# Altium schematic sheet atmega_darlington_diodes.SchDoc
size A4
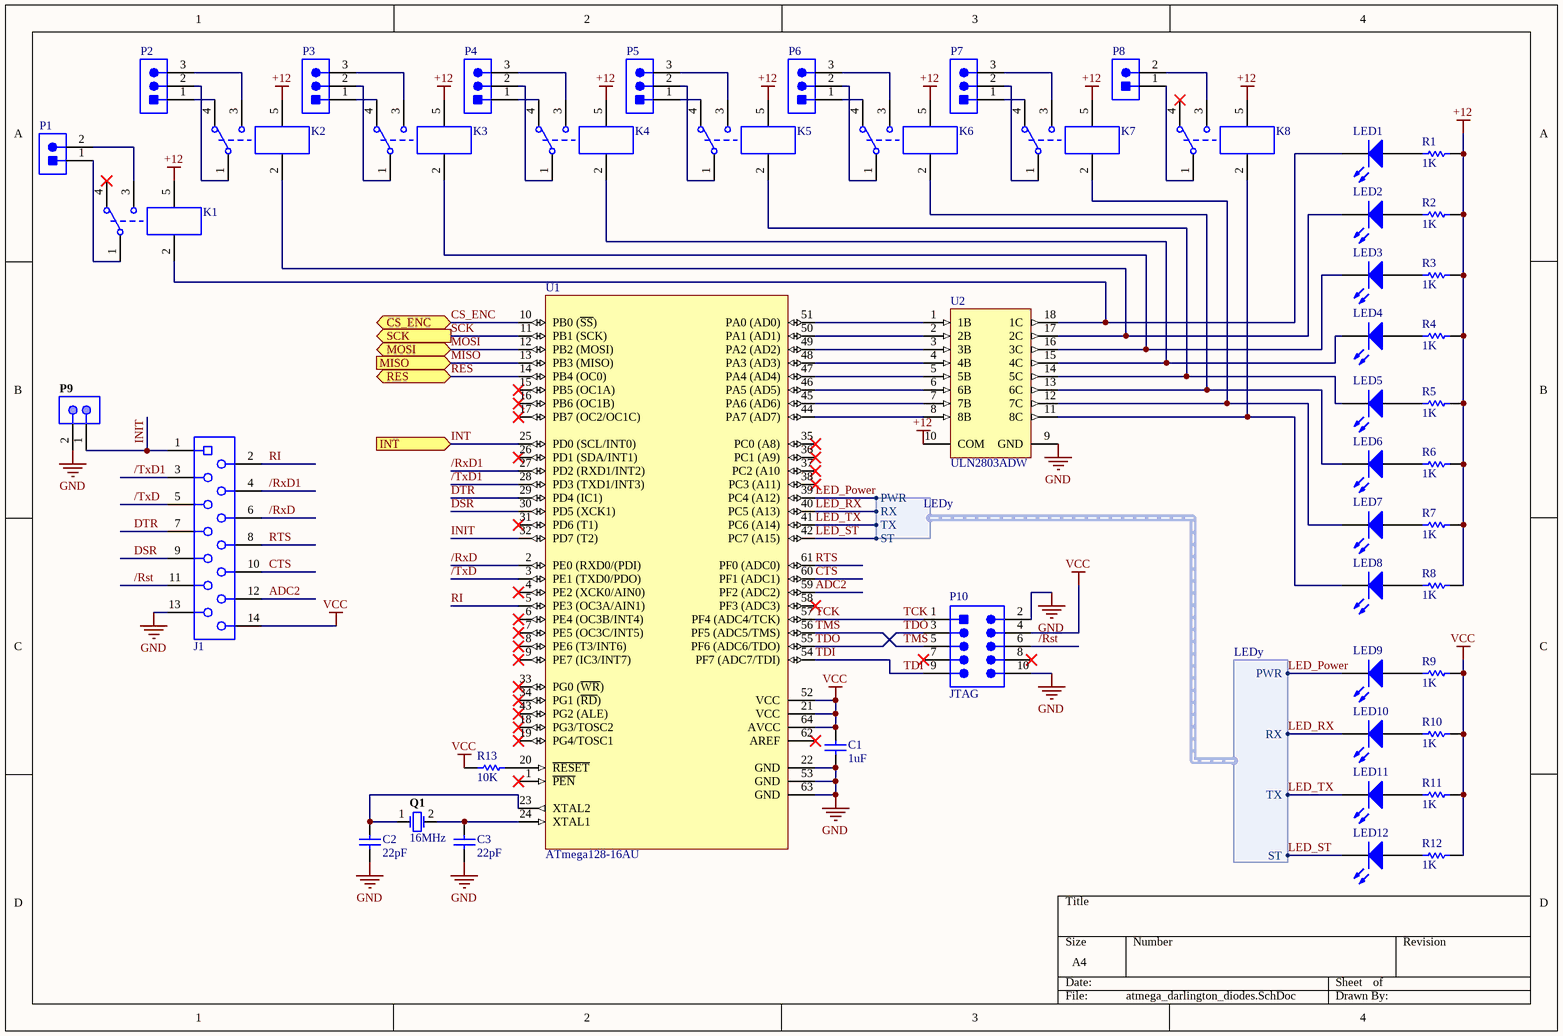
[diagram p0: atmega_darlington_diodes.SchDoc]

## Parts
C1  1uF  [CAPC1206(3216)130_L]
C2  22pF  [CAPC1206(3216)100_L]
C3  22pF  [CAPC1206(3216)100_L]
J1  490107671412  [490107671412]  (value not drawn)
K1  JS1-12V  [PNSC-JS1-12V_V]  (value not drawn)
K2  JS1-12V  [PNSC-JS1-12V_V]  (value not drawn)
K3  JS1-12V  [PNSC-JS1-12V_V]  (value not drawn)
K4  JS1-12V  [PNSC-JS1-12V_V]  (value not drawn)
K5  JS1-12V  [PNSC-JS1-12V_V]  (value not drawn)
K6  JS1-12V  [PNSC-JS1-12V_V]  (value not drawn)
K7  JS1-12V  [PNSC-JS1-12V_V]  (value not drawn)
K8  JS1-12V  [PNSC-JS1-12V_V]  (value not drawn)
LED1  150120YS75000  [1206_A]  (value not drawn)
LED2  150120YS75000  [1206_A]  (value not drawn)
LED3  150120YS75000  [1206_A]  (value not drawn)
LED4  150120YS75000  [1206_A]  (value not drawn)
LED5  150120YS75000  [1206_A]  (value not drawn)
LED6  150120YS75000  [1206_A]  (value not drawn)
LED7  150120YS75000  [1206_A]  (value not drawn)
LED8  150120YS75000  [1206_A]  (value not drawn)
LED9  150120BS75000  [1206_A]  (value not drawn)
LED10  150120GS75000  [1206_A]  (value not drawn)
LED11  150120YS75000  [1206_A]  (value not drawn)
LED12  150120RS75000  [1206_A]  (value not drawn)
P1  SCREW-5.0/5.08 2WAYS  [SCREW-5.0-2WAYS_V]  (value not drawn)
P2  SCREW-5.0/5.08 3WAYS  [SCREW-5.0-3WAYS_V]  (value not drawn)
P3  SCREW-5.0/5.08 3WAYS  [SCREW-5.0-3WAYS_V]  (value not drawn)
P4  SCREW-5.0/5.08 3WAYS  [SCREW-5.0-3WAYS_V]  (value not drawn)
P5  SCREW-5.0/5.08 3WAYS  [SCREW-5.0-3WAYS_V]  (value not drawn)
P6  SCREW-5.0/5.08 3WAYS  [SCREW-5.0-3WAYS_V]  (value not drawn)
P7  SCREW-5.0/5.08 3WAYS  [SCREW-5.0-3WAYS_V]  (value not drawn)
P8  SCREW-5.0/5.08 2WAYS  [SCREW-5.0-2WAYS_V]  (value not drawn)
P9  PH2541-2-SPGRH-6-3  [PH2541-2-SPGRH-6-3_V]  (value not drawn)
P10  JTAG  [3M-2510-6002_V]
Q1  16MHz  [JPY-HC-49US]
R1  1K  [RESC1206(3216)_L]
R2  1K  [RESC1206(3216)_L]
R3  1K  [RESC1206(3216)_L]
R4  1K  [RESC1206(3216)_L]
R5  1K  [RESC1206(3216)_L]
R6  1K  [RESC1206(3216)_L]
R7  1K  [RESC1206(3216)_L]
R8  1K  [RESC1206(3216)_L]
R9  1K  [RESC1206(3216)_L]
R10  1K  [RESC1206(3216)_L]
R11  1K  [RESC1206(3216)_L]
R12  1K  [RESC1206(3216)_L]
R13  10K  [RESC1206(3216)_L]
U1  ATmega128-16AU  [64A_L]
U2  ULN2803ADW  [DW0018A_L]

## Ports
CS_ENC (bidir), INT (in), MISO (in), MOSI (bidir), RES (bidir), SCK (out)

## Harnesses
LEDy: PWR, RX, TX, ST

## Nets
+12: K1.5 K2.5 K3.5 K4.5 K5.5 K6.5 K7.5 K8.5 R1.2 R2.2 R3.2 R4.2 R5.2 R6.2 R7.2 R8.2 U2.10(COM)
GND: C1.1 C2.1 C3.1 J1.13 P9.2 P10.2 P10.10 U1.22(GND) U1.53(GND) U1.63(GND) U2.9(GND)
VCC: C1.2 J1.14 P10.4 R9.2 R10.2 R11.2 R12.2 R13.1 U1.21(VCC) U1.52(VCC) U1.64(AVCC)
/Rst: J1.11 P10.6
/RxD: J1.6 U1.2(PE0_(RXD0/(PDI))
/RxD1: J1.4 U1.27(PD2_(RXD1/INT2))
/TxD: J1.5 U1.3(PE1_(TXD0/PDO))
/TxD1: J1.3 U1.28(PD3_(TXD1/INT3))
ADC2: J1.12 U1.59(PF2_(ADC2))
CS_ENC: U1.10(PB0_(~{SS})) ; port CS_ENC
CTS: J1.10 U1.60(PF1_(ADC1))
DSR: J1.9 U1.30(PD5_(XCK1))
DTR: J1.7 U1.29(PD4_(IC1))
INIT: J1.1 P9.1 U1.32(PD7_(T2))
INT: U1.25(PD0_(SCL/INT0)) ; port INT
LED_Power: LED9.1(K) U1.39(PC4_(A12)) ; harness LEDy.PWR
LED_RX: LED10.1(K) U1.40(PC5_(A13)) ; harness LEDy.RX
LED_ST: LED12.1(K) U1.42(PC7_(A15)) ; harness LEDy.ST
LED_TX: LED11.1(K) U1.41(PC6_(A14)) ; harness LEDy.TX
MISO: U1.13(PB3_(MISO)) ; port MISO
MOSI: U1.12(PB2_(MOSI)) ; port MOSI
RES: U1.14(PB4_(OC0)) ; port RES
RI: J1.2 U1.5(PE3_(OC3A/AIN1))
RTS: J1.8 U1.61(PF0_(ADC0))
SCK: U1.11(PB1_(SCK)) ; port SCK
TCK: P10.1 U1.57(PF4_(ADC4/TCK))
TDI: P10.9 U1.54(PF7_(ADC7/TDI))
TDO: P10.3 U1.55(PF6_(ADC6/TDO))
TMS: P10.5 U1.56(PF5_(ADC5/TMS))
NetC2_2: C2.2 Q1.1 U1.23(XTAL2)
NetC3_2: C3.2 Q1.2 U1.24(XTAL1)
NetK1_1: K1.1(COM) P1.1
NetK1_2: K1.2 LED1.1(K) U2.18(1C)
NetK1_3: K1.3(N.O.) P1.2
NetK2_1: K2.1(COM) P2.2
NetK2_2: K2.2 LED2.1(K) U2.17(2C)
NetK2_3: K2.3(N.O.) P2.3
NetK2_4: K2.4(N.C.) P2.1
NetK3_1: K3.1(COM) P3.2
NetK3_2: K3.2 LED3.1(K) U2.16(3C)
NetK3_3: K3.3(N.O.) P3.3
NetK3_4: K3.4(N.C.) P3.1
NetK4_1: K4.1(COM) P4.2
NetK4_2: K4.2 LED4.1(K) U2.15(4C)
NetK4_3: K4.3(N.O.) P4.3
NetK4_4: K4.4(N.C.) P4.1
NetK5_1: K5.1(COM) P5.2
NetK5_2: K5.2 LED5.1(K) U2.14(5C)
NetK5_3: K5.3(N.O.) P5.3
NetK5_4: K5.4(N.C.) P5.1
NetK6_1: K6.1(COM) P6.2
NetK6_2: K6.2 LED6.1(K) U2.13(6C)
NetK6_3: K6.3(N.O.) P6.3
NetK6_4: K6.4(N.C.) P6.1
NetK7_1: K7.1(COM) P7.2
NetK7_2: K7.2 LED7.1(K) U2.12(7C)
NetK7_3: K7.3(N.O.) P7.3
NetK7_4: K7.4(N.C.) P7.1
NetK8_1: K8.1(COM) P8.1
NetK8_2: K8.2 LED8.1(K) U2.11(8C)
NetK8_3: K8.3(N.O.) P8.2
NetLED1_2: LED1.2(A) R1.1
NetLED2_2: LED2.2(A) R2.1
NetLED3_2: LED3.2(A) R3.1
NetLED4_2: LED4.2(A) R4.1
NetLED5_2: LED5.2(A) R5.1
NetLED6_2: LED6.2(A) R6.1
NetLED7_2: LED7.2(A) R7.1
NetLED8_2: LED8.2(A) R8.1
NetLED9_2: LED9.2(A) R9.1
NetLED10_2: LED10.2(A) R10.1
NetLED11_2: LED11.2(A) R11.1
NetLED12_2: LED12.2(A) R12.1
NetR13_2: R13.2 U1.20(~{RESET})
NetU1_44: U1.44(PA7_(AD7)) U2.8(8B)
NetU1_45: U1.45(PA6_(AD6)) U2.7(7B)
NetU1_46: U1.46(PA5_(AD5)) U2.6(6B)
NetU1_47: U1.47(PA4_(AD4)) U2.5(5B)
NetU1_48: U1.48(PA3_(AD3)) U2.4(4B)
NetU1_49: U1.49(PA2_(AD2)) U2.3(3B)
NetU1_50: U1.50(PA1_(AD1)) U2.2(2B)
NetU1_51: U1.51(PA0_(AD0)) U2.1(1B)

Not connected (* = marked no-connect by the designer): K1 4(N.C.)*; K8 4(N.C.)*; P10 7* 8*; U1 1(~{PEN})* 4(PE2_(XCK0/AIN0))* 6(PE4_(OC3B/INT4))* 7(PE5_(OC3C/INT5))* 8(PE6_(T3/INT6))* 9(PE7_(IC3/INT7))* 15(PB5_(OC1A))* 16(PB6_(OC1B))* 17(PB7_(OC2/OC1C))* 18(PG3/TOSC2)* 19(PG4/TOSC1)* 26(PD1_(SDA/INT1))* 31(PD6_(T1))* 33(PG0_(~{WR}))* 34(PG1_(~{RD}))* 35(PC0_(A8))* 36(PC1_(A9))* 37(PC2_(A10)* 38(PC3_(A11))* 43(PG2_(ALE))* 58(PF3_(ADC3))* 62(AREF)*

## Library data of the parts
C1 = CMP-1037-04671-1: CAP 1uF 10V ±5% 1206 (3216 Metric) Thickness 1.3mm SMD; Case-EIA: 1206; Tolerance: Â±5%; Case-Metric: 3216; Value: 1uF; Technology: SMT; Rated Voltage: 10 V; Max Thickness: 1.3 mm
C2 C3 = CMP-1037-00952-1: CAP 22pF 10V ±0.25pF 1206 (3216 Metric) Thickness 1mm SMD; Tolerance: Â±0.25pF; Case-EIA: 1206; Case-Metric: 3216; Rated Voltage: 10 V; Technology: SMT; Max Thickness: 1 mm; Value: 22pF
J1 = CMP-1502-02453-1: REDFIT IDC SKEDD Connector WR-WST, pitch 2.54 mm, 14 pins; Manufacturer: Wurth Elektronik; Pin Number: 14; Pitch: 2.54mm; Contact Resistance: 10mOhm; Rated Current: 1A; Working Voltage: 500VAC; PCB Thickness: 1.6mm; Part Number: 490107671412; Package Reference: 490107671412; Operating Temperature: -25to105degC; Publisher: WurthElektronik; Manufacturer URL: http://www.we-online.de; Packaging: Tube; Mounting Technology: Plug-in; Datasheet URL: https://katalog.we-online.de/em/datasheet/490107671412.pdf
K1-K8 = CMP-2000-06502-1: Cubic Type 1C Power Relay, SPDT, 10 A, 12 V, -40 to 70 degC, 5-Pin THD, RoHS, Bulk; Manufacturer: Panasonic; Material, contact: Silveralloy; Current, switch max: 10A; External Width: 22mm; Contact Voltage DC Nom: 100V; Power, coil DC: 360mW; Coil operating upper percent limit: 130%; Coil Resistance: 400ohm; Relay Mounting: ThroughHole; Coil Type: DC; External Height: 16mm; Coil Current: 30mA; Resistance, coil: 400R; Approval Bodies: UL&CSA,TUV; Voltage, switching AC/DC min: 277Vac; Voltage, contact AC max: 125V; Time, operating: 10ms; Current, contact min: 6A@277Vac; Coil Voltage VDC Nom: 12V; Configuration, contact: SPCO; Contact Voltage AC Nom: 277V; Temperature, operating (a) max: 70°C; Temperature, operating (a) min: -40°C; Coil operating lower percent limit: 70%; Width, external: 16.4mm; Current, contact AC max: 10A; Relay Type: Power; External Depth: 22mm; Package Reference: JS1-12V; Mounting Technology: ThroughHole; Diameter, PCB hole: 1.3mm; Depth, external: 16.4mm; Length / Height, external: 22mm; Nom Operating Power: 360mW; Time, release: 10ms; Datasheet URL: https://www3.panasonic.biz/ac/e_download/control/relay/power/catalog/mech_eng_js.pdf; Voltage, coil DC nom: 12V; Contact Current Max: 10A; Manufacturer URL: http://www.panasonic.com/; Contact Configuration: SPDT; Package Description: 5-Pin Through Hole Device, Body 22 x 16 mm; Datasheet Version: 12/2016
LED1-LED8 LED11 = CMP-1426-00019-1: SMD mono-color Chip LED, WL-SMCW, Yellow; Manufacturer: Wuerth Elektronik; ComponentLink2URL: http://katalog.we-online.com/led/datasheet/150120YS75000.pdf; PartNumber: 150120YS75000; ComponentLink1URL: http://www.we-online.com; Color: Yellow; ComponentLink1Description: Manufacturer URL; PackageReference: 1206_A; ComponentLink2Description: Datasheet
LED9 = CMP-1426-00015-1: SMD mono-color Chip LED, WL-SMCW, Blue; Manufacturer: Wuerth Elektronik; ComponentLink2Description: Datasheet; ComponentLink1URL: http://www.we-online.com; PartNumber: 150120BS75000; ComponentLink1Description: Manufacturer URL; ComponentLink2URL: http://katalog.we-online.com/led/datasheet/150120BS75000.pdf; PackageReference: 1206_A; Color: Blue
LED10 = CMP-1426-00014-1: SMD mono-color Chip LED, WL-SMCW, Green; Manufacturer: Wuerth Elektronik; PackageReference: 1206_A; PartNumber: 150120GS75000; ComponentLink1Description: Manufacturer URL; ComponentLink2URL: http://katalog.we-online.com/led/datasheet/150120GS75000.pdf; ComponentLink2Description: Datasheet; Color: Green; ComponentLink1URL: http://www.we-online.com
LED12 = CMP-1426-00013-1: SMD mono-color Chip LED, WL-SMCW, Red; Manufacturer: Wuerth Elektronik; Color: Red; ComponentLink2URL: http://katalog.we-online.com/led/datasheet/150120RS75000.pdf; ComponentLink2Description: Datasheet; ComponentLink1Description: Manufacturer URL; ComponentLink1URL: http://www.we-online.com; PartNumber: 150120RS75000; PackageReference: 1206_A
P1 P8 = CMP-0617-00009-1: Socket, Screw Terminal Block, 2 Way, 5.0 mm Pitch, 90 Degree Angle, Through-Hole; Manufacturer: No Vendor; Insulation Resistance: 5000 MOhm / 1000 V; Contact Resistance: 20 mOhm; Rated Current: 25 A; Poles: 2; Rated Voltage: 300 V; PartNumber: SCREW-5.0/5.08 2WAYS; ComponentLink1Description: Datasheet; ComponentLink1URL: 5mm screw terminal in SVN; Mounting Technology: Through Hole; PackageDescription: Socket, Screw Terminal Block, 2 Way, Pitch 5 mm, 90 Degree Angle, Through-Hole; Temperature Range: -40 to 105 degC
P2-P7 = CMP-0617-00010-1: Socket, Screw Terminal Block, 3 Way, 5.0 mm Pitch, 90 Degree Angle, Through-Hole; Manufacturer: No Vendor; Insulation Resistance: 5000 MOhm / 1000 V; Rated Voltage: 300 V; Poles: 3; Contact Resistance: 20 mOhm; Rated Current: 25 A; PartNumber: SCREW-5.0/5.08 3WAYS; PackageDescription: Socket, Screw Terminal Block, 3 Way, Pitch 5 mm, 90 Degree Angle, Through-Hole; Temperature Range: -40 to 105 degC; ComponentLink1Description: Datasheet; ComponentLink1URL: 5mm screw terminal in SVN; Mounting Technology: Through Hole
P9 = CMP-0261-00001-1: Male Header, Pitch 2.54mm, 2x1 Position, Mated Height 6mm, Tail Length 3mm; PackageDescription: 2-Pin Male Header IDC, 2.54 x 5.08 mm Body, 2.54 mm Pitch; PartNumber: PH2541-2-SPGRH-6-3; ComponentLink1URL: http://www.suzhoupinchao.com/; Mounting Technology: Through Hole; ComponentLink1Description: Manufacturer URL; PackageReference: PH2541-2-SPGRH-6-3
P10 = CMP-2000-05545-1: Male Header, Pitch 2.54 mm, 2 x 5 Position, Height 9.91 mm, Tail Length 2.84 mm, -55 to 105 degC, RoHS, Bulk; Manufacturer: 3M; Associated Product: 3505-33(1000BX)-ND / -CONNEJECTORLATCHLONGSNAP-IN; Pitch: 0.100"(2.54mm); Catalog Drawings: 6002UB,RBSeries; Dynamic Catalog: 2500Series; Connector Type: Header,Shrouded; Other Names: 5400782713 / 54007827139 / 80-6105-6503-0 / 80610565030 / MHB10G / MHB10K; Product Training Modules: IDCWiremountConnectorsPrimer; Number of Positions Loaded: All; Mating Products: CHG-2010-S01010-KEP-ND / -CONNRCPTIDC10POS24-22AWG / 3M11964-ND / -CONNSOCKET10POSIDCW/STRREL / 89110-0003-ND / -CONNSOCKET10POSIDCW/STRREL / 5110-B7A2PL-ND / -10/2R/BMSKT/.100 / MKC10E-ND / -CONN10POSIDCSOCKET10AUW/POL / MSC10E-ND / -CONN10POSIDCSOCKET15GOLD / D89110-0101HK-ND / -CONN10POSIDCSOCKETGOLDW/POL / D89110-0001HK-ND / -CONN10POSIDCSOCKETGOLD / MSPV10-ND / -CONNSOCKETPCBVERT10POS.1" / 3M9088-ND / -CONNRECEPTIDC10POS24-22AWG / More...; Number of Positions: 10; Category: Connectors,Interconnects; Datasheet Version: Rev. M, 08/2014; Datasheet URL: http://multimedia.3m.com/mws/media/330367O/3mtm-100-in-4-wall-hdr-rohs-lp-straightra-hitemp-ts0770.pdf; Series: 2500; Contact Finish: Gold; Number of Rows: 2; Standard Package: 784; Color: Gray; Package Description: Male Header, Pitch 2.54 mm, 2 x 5 Position, Height 9.91 mm, Tail Length 2.84 mm; Packaging: Bulk; Contact Type: MalePin; Mounting Technology: ThroughHole; Family: RectangularConnectors-Headers,MalePins; Contact Mating Length: 0.243"(6.17mm); Termination: Solder; Row Spacing: 0.100"(2.54mm); Package Reference: 2510-6002; Contact Finish Thickness: 30µin(0.76µm); Mounting Type: ThroughHole; Manufacturer URL: http://www.3m.com/
Q1 = CMP-2100-03645-1: Crystal, 16 MHz, +/- 30 ppm, 18 pF, -20 to 70 degC, 2-Pin THD; Manufacturer: Jing peng yuan; Datasheet URL: https://statics3.seeedstudio.com/images/opl/datasheet/306010014.pdf; Package Description: 2-Pin Throug Hole Device, Body 11.05 x 4.65 mm, Pitch 4.9 mm; Datasheet Version: 42125.0; Package Reference: HC-49US
R1-R12 = CMP-1014-00510-1: 1K 0.25W 1% 1206 (3216 Metric)  SMD; Case-Metric: 3216; Case-EIA: 1206; Value: 1000.00 Ohm; Power: 0.25 W; Tolerance: 1 %; Technology: SMT
R13 = CMP-1014-00623-1: 10K 0.25W 1% 1206 (3216 Metric)  SMD; Case-Metric: 3216; Value: 10000.00 Ohm; Case-EIA: 1206; Power: 0.25 W; Technology: SMT; Tolerance: 1 %
U1 = CMP-0095-00653-1: 8-bit AVR Microcontroller, 4.5-5.5V, 128KB Flash, 4KB EEPROM, 4KB SRAM, 64-pin TQFP, Industrial Grade (-40°C to 85°C), Reel; ComponentLink2URL: http://www.atmel.com/dyn/resources/prod_documents/doc2467.pdf; PackageVersion: revC, Oct-2010; ComponentLink3Description: ATmega128(L) Summary; PackageDescription: 64-Pin Plastic Thin Profile Quad Flat Pack, 14 x 14 x 1.0 mm Body, 0.8 mm Pitch (TQFP); ComponentLink1URL: http://www.atmel.com/; PackageReference: 64A; ComponentLink1Description: Manufacturer URL; DatasheetVersion: revX, Jun-2011; ComponentLink3URL: http://www.atmel.com/dyn/resources/prod_documents/2467S.pdf; ComponentLink2Description: ATmega128(L) Datasheet; Code_JEDEC: MS-026-AEB
U2 = CMP-2000-07353-1: Darlington Transistor NPN, 50 V, 0.5 A, -40 to 85 degC, 18-Pin SOIC (DW), Green (RoHS & no Sb/Br), Tube; Manufacturer: Texas Instruments; Base Number: 2803; Package Version: 4040000-3/G, 01/2011; SVHC: NoSVHC(19-Dec-2012); Module Configuration: Eight; No. of Pins: 18; No. of Transistors: 8; Current Ic Continuous a Max: 500mA; Collector Emitter Voltage V(br)ceo: 50V; Id: 0.5A; Datasheet URL: http://www.ti.com/lit/ds/symlink/uln2803a.pdf; Package / Case: 18-SOIC; Operating Temperature Range: -40°Cto+85°C; Manufacturer URL: http://www.ti.com/; Package Reference: DW18; DC Collector Current: 500mA; Transistor Case Style: SOIC; Transistor Polarity: NPN; Operating Temperature Min: -40°C; Device Marking: ULN2803ADW; Datasheet Version: Rev. G, 01/2015; Package URL: http://www.ti.com/lit/ml/mpds172a/mpds172a.pdf; Operating Temperature Max: 85°C; Mounting Technology: SurfaceMount; MSL: MSL2-1year; Package Description: 18-Pin Plastic Small Outline, Body 11.55 x 7.5 mm, Pitch 1.27 mm